# Altium schematic sheet ASIC_1.SchDoc: Title
size A2; Date: Date; CompanyName: Integrated Micro-Electronics Bulgaria; Organization: Design & Development Department; Address1: Drawing Type; Address2: Address 1; Address3: Address 2; Address4: Address 3; DocumentNumber: 730xxx; Revision: 01; SheetNumber: 1; SheetTotal: 1; PageSetup: Record=PageOptions|CenterHorizontal=True|CenterVertical=True|PrintScale=0.70|XCorrection=1.00|YCorrection=1.00|PrintKind=2|BorderSize=5000000|LeftOffset=0|BottomOffset=0|Orientation=2|PaperLength=1000|PaperWidth=1000|Scale=100|PaperSource=7|PrintQuality=-4|MediaType=1|DitherType=10|PaperKind=A4|PrintScaleMode=1; SheetSize: A3; Time: Time; ModifiedDate: Mod. Date
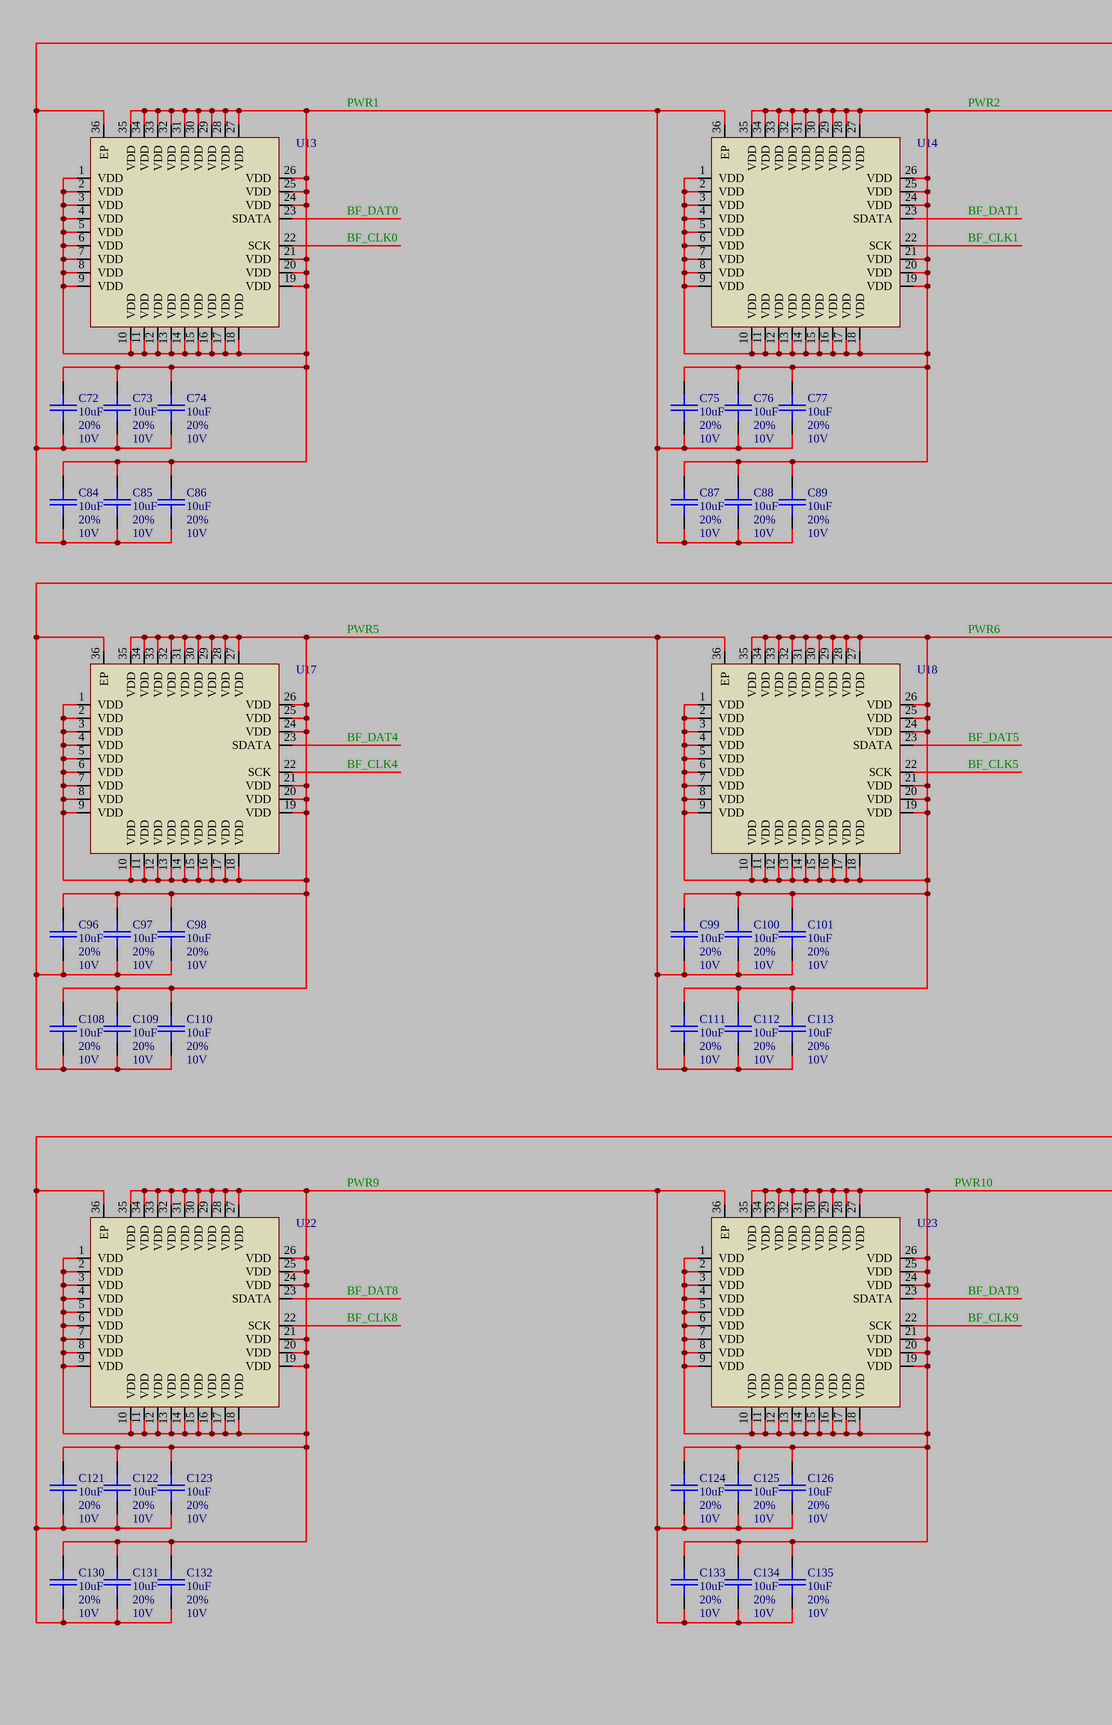
[diagram p0: ASIC_1.SchDoc, left]
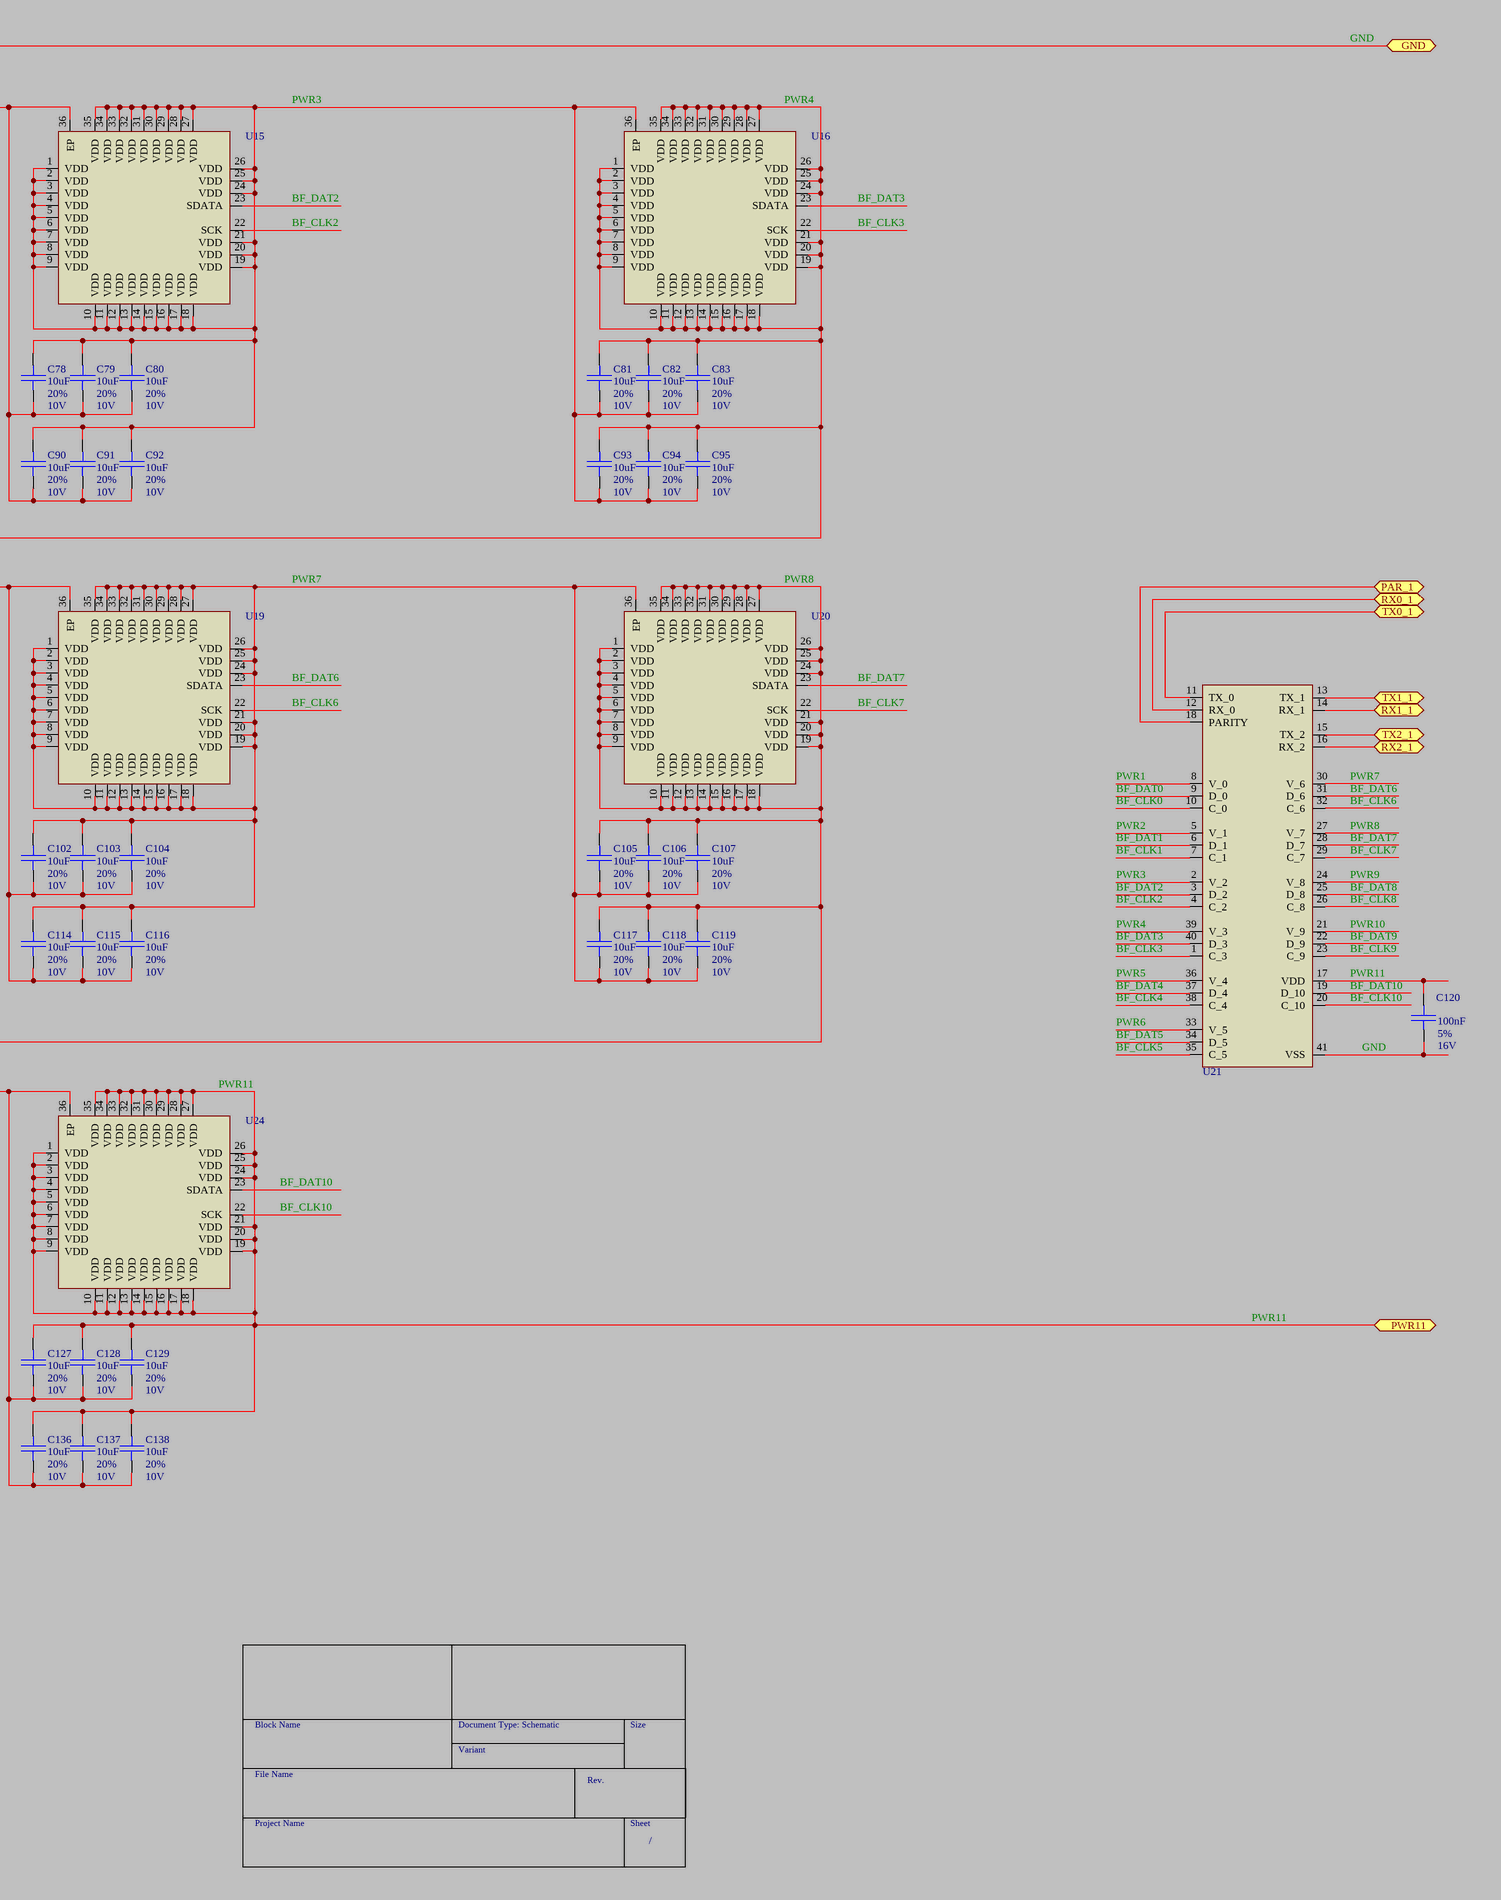
[diagram p1: ASIC_1.SchDoc, right]

## Parts
C72  DB_VALUE: 10uF  DB_TOLERANCE: 20%  DB_VOLTAGE: 10V  [SMD_0402_CAPC1005X70N]  (hidden comment: C)
C73  DB_VALUE: 10uF  DB_TOLERANCE: 20%  DB_VOLTAGE: 10V  [SMD_0402_CAPC1005X70N]  (hidden comment: C)
C74  DB_VALUE: 10uF  DB_TOLERANCE: 20%  DB_VOLTAGE: 10V  [SMD_0402_CAPC1005X70N]  (hidden comment: C)
C75  DB_VALUE: 10uF  DB_TOLERANCE: 20%  DB_VOLTAGE: 10V  [SMD_0402_CAPC1005X70N]  (hidden comment: C)
C76  DB_VALUE: 10uF  DB_TOLERANCE: 20%  DB_VOLTAGE: 10V  [SMD_0402_CAPC1005X70N]  (hidden comment: C)
C77  DB_VALUE: 10uF  DB_TOLERANCE: 20%  DB_VOLTAGE: 10V  [SMD_0402_CAPC1005X70N]  (hidden comment: C)
C78  DB_VALUE: 10uF  DB_TOLERANCE: 20%  DB_VOLTAGE: 10V  [SMD_0402_CAPC1005X70N]  (hidden comment: C)
C79  DB_VALUE: 10uF  DB_TOLERANCE: 20%  DB_VOLTAGE: 10V  [SMD_0402_CAPC1005X70N]  (hidden comment: C)
C80  DB_VALUE: 10uF  DB_TOLERANCE: 20%  DB_VOLTAGE: 10V  [SMD_0402_CAPC1005X70N]  (hidden comment: C)
C81  DB_VALUE: 10uF  DB_TOLERANCE: 20%  DB_VOLTAGE: 10V  [SMD_0402_CAPC1005X70N]  (hidden comment: C)
C82  DB_VALUE: 10uF  DB_TOLERANCE: 20%  DB_VOLTAGE: 10V  [SMD_0402_CAPC1005X70N]  (hidden comment: C)
C83  DB_VALUE: 10uF  DB_TOLERANCE: 20%  DB_VOLTAGE: 10V  [SMD_0402_CAPC1005X70N]  (hidden comment: C)
C84  DB_VALUE: 10uF  DB_TOLERANCE: 20%  DB_VOLTAGE: 10V  [SMD_0402_CAPC1005X70N]  (hidden comment: C)
C85  DB_VALUE: 10uF  DB_TOLERANCE: 20%  DB_VOLTAGE: 10V  [SMD_0402_CAPC1005X70N]  (hidden comment: C)
C86  DB_VALUE: 10uF  DB_TOLERANCE: 20%  DB_VOLTAGE: 10V  [SMD_0402_CAPC1005X70N]  (hidden comment: C)
C87  DB_VALUE: 10uF  DB_TOLERANCE: 20%  DB_VOLTAGE: 10V  [SMD_0402_CAPC1005X70N]  (hidden comment: C)
C88  DB_VALUE: 10uF  DB_TOLERANCE: 20%  DB_VOLTAGE: 10V  [SMD_0402_CAPC1005X70N]  (hidden comment: C)
C89  DB_VALUE: 10uF  DB_TOLERANCE: 20%  DB_VOLTAGE: 10V  [SMD_0402_CAPC1005X70N]  (hidden comment: C)
C90  DB_VALUE: 10uF  DB_TOLERANCE: 20%  DB_VOLTAGE: 10V  [SMD_0402_CAPC1005X70N]  (hidden comment: C)
C91  DB_VALUE: 10uF  DB_TOLERANCE: 20%  DB_VOLTAGE: 10V  [SMD_0402_CAPC1005X70N]  (hidden comment: C)
C92  DB_VALUE: 10uF  DB_TOLERANCE: 20%  DB_VOLTAGE: 10V  [SMD_0402_CAPC1005X70N]  (hidden comment: C)
C93  DB_VALUE: 10uF  DB_TOLERANCE: 20%  DB_VOLTAGE: 10V  [SMD_0402_CAPC1005X70N]  (hidden comment: C)
C94  DB_VALUE: 10uF  DB_TOLERANCE: 20%  DB_VOLTAGE: 10V  [SMD_0402_CAPC1005X70N]  (hidden comment: C)
C95  DB_VALUE: 10uF  DB_TOLERANCE: 20%  DB_VOLTAGE: 10V  [SMD_0402_CAPC1005X70N]  (hidden comment: C)
C96  DB_VALUE: 10uF  DB_TOLERANCE: 20%  DB_VOLTAGE: 10V  [SMD_0402_CAPC1005X70N]  (hidden comment: C)
C97  DB_VALUE: 10uF  DB_TOLERANCE: 20%  DB_VOLTAGE: 10V  [SMD_0402_CAPC1005X70N]  (hidden comment: C)
C98  DB_VALUE: 10uF  DB_TOLERANCE: 20%  DB_VOLTAGE: 10V  [SMD_0402_CAPC1005X70N]  (hidden comment: C)
C99  DB_VALUE: 10uF  DB_TOLERANCE: 20%  DB_VOLTAGE: 10V  [SMD_0402_CAPC1005X70N]  (hidden comment: C)
C100  DB_VALUE: 10uF  DB_TOLERANCE: 20%  DB_VOLTAGE: 10V  [SMD_0402_CAPC1005X70N]  (hidden comment: C)
C101  DB_VALUE: 10uF  DB_TOLERANCE: 20%  DB_VOLTAGE: 10V  [SMD_0402_CAPC1005X70N]  (hidden comment: C)
C102  DB_VALUE: 10uF  DB_TOLERANCE: 20%  DB_VOLTAGE: 10V  [SMD_0402_CAPC1005X70N]  (hidden comment: C)
C103  DB_VALUE: 10uF  DB_TOLERANCE: 20%  DB_VOLTAGE: 10V  [SMD_0402_CAPC1005X70N]  (hidden comment: C)
C104  DB_VALUE: 10uF  DB_TOLERANCE: 20%  DB_VOLTAGE: 10V  [SMD_0402_CAPC1005X70N]  (hidden comment: C)
C105  DB_VALUE: 10uF  DB_TOLERANCE: 20%  DB_VOLTAGE: 10V  [SMD_0402_CAPC1005X70N]  (hidden comment: C)
C106  DB_VALUE: 10uF  DB_TOLERANCE: 20%  DB_VOLTAGE: 10V  [SMD_0402_CAPC1005X70N]  (hidden comment: C)
C107  DB_VALUE: 10uF  DB_TOLERANCE: 20%  DB_VOLTAGE: 10V  [SMD_0402_CAPC1005X70N]  (hidden comment: C)
C108  DB_VALUE: 10uF  DB_TOLERANCE: 20%  DB_VOLTAGE: 10V  [SMD_0402_CAPC1005X70N]  (hidden comment: C)
C109  DB_VALUE: 10uF  DB_TOLERANCE: 20%  DB_VOLTAGE: 10V  [SMD_0402_CAPC1005X70N]  (hidden comment: C)
C110  DB_VALUE: 10uF  DB_TOLERANCE: 20%  DB_VOLTAGE: 10V  [SMD_0402_CAPC1005X70N]  (hidden comment: C)
C111  DB_VALUE: 10uF  DB_TOLERANCE: 20%  DB_VOLTAGE: 10V  [SMD_0402_CAPC1005X70N]  (hidden comment: C)
C112  DB_VALUE: 10uF  DB_TOLERANCE: 20%  DB_VOLTAGE: 10V  [SMD_0402_CAPC1005X70N]  (hidden comment: C)
C113  DB_VALUE: 10uF  DB_TOLERANCE: 20%  DB_VOLTAGE: 10V  [SMD_0402_CAPC1005X70N]  (hidden comment: C)
C114  DB_VALUE: 10uF  DB_TOLERANCE: 20%  DB_VOLTAGE: 10V  [SMD_0402_CAPC1005X70N]  (hidden comment: C)
C115  DB_VALUE: 10uF  DB_TOLERANCE: 20%  DB_VOLTAGE: 10V  [SMD_0402_CAPC1005X70N]  (hidden comment: C)
C116  DB_VALUE: 10uF  DB_TOLERANCE: 20%  DB_VOLTAGE: 10V  [SMD_0402_CAPC1005X70N]  (hidden comment: C)
C117  DB_VALUE: 10uF  DB_TOLERANCE: 20%  DB_VOLTAGE: 10V  [SMD_0402_CAPC1005X70N]  (hidden comment: C)
C118  DB_VALUE: 10uF  DB_TOLERANCE: 20%  DB_VOLTAGE: 10V  [SMD_0402_CAPC1005X70N]  (hidden comment: C)
C119  DB_VALUE: 10uF  DB_TOLERANCE: 20%  DB_VOLTAGE: 10V  [SMD_0402_CAPC1005X70N]  (hidden comment: C)
C120  DB_VALUE: 100nF  DB_TOLERANCE: 5%  DB_VOLTAGE: 16V  [SMD_0603_CAPC1608X95N]  (hidden comment: C)
C121  DB_VALUE: 10uF  DB_TOLERANCE: 20%  DB_VOLTAGE: 10V  [SMD_0402_CAPC1005X70N]  (hidden comment: C)
C122  DB_VALUE: 10uF  DB_TOLERANCE: 20%  DB_VOLTAGE: 10V  [SMD_0402_CAPC1005X70N]  (hidden comment: C)
C123  DB_VALUE: 10uF  DB_TOLERANCE: 20%  DB_VOLTAGE: 10V  [SMD_0402_CAPC1005X70N]  (hidden comment: C)
C124  DB_VALUE: 10uF  DB_TOLERANCE: 20%  DB_VOLTAGE: 10V  [SMD_0402_CAPC1005X70N]  (hidden comment: C)
C125  DB_VALUE: 10uF  DB_TOLERANCE: 20%  DB_VOLTAGE: 10V  [SMD_0402_CAPC1005X70N]  (hidden comment: C)
C126  DB_VALUE: 10uF  DB_TOLERANCE: 20%  DB_VOLTAGE: 10V  [SMD_0402_CAPC1005X70N]  (hidden comment: C)
C127  DB_VALUE: 10uF  DB_TOLERANCE: 20%  DB_VOLTAGE: 10V  [SMD_0402_CAPC1005X70N]  (hidden comment: C)
C128  DB_VALUE: 10uF  DB_TOLERANCE: 20%  DB_VOLTAGE: 10V  [SMD_0402_CAPC1005X70N]  (hidden comment: C)
C129  DB_VALUE: 10uF  DB_TOLERANCE: 20%  DB_VOLTAGE: 10V  [SMD_0402_CAPC1005X70N]  (hidden comment: C)
C130  DB_VALUE: 10uF  DB_TOLERANCE: 20%  DB_VOLTAGE: 10V  [SMD_0402_CAPC1005X70N]  (hidden comment: C)
C131  DB_VALUE: 10uF  DB_TOLERANCE: 20%  DB_VOLTAGE: 10V  [SMD_0402_CAPC1005X70N]  (hidden comment: C)
C132  DB_VALUE: 10uF  DB_TOLERANCE: 20%  DB_VOLTAGE: 10V  [SMD_0402_CAPC1005X70N]  (hidden comment: C)
C133  DB_VALUE: 10uF  DB_TOLERANCE: 20%  DB_VOLTAGE: 10V  [SMD_0402_CAPC1005X70N]  (hidden comment: C)
C134  DB_VALUE: 10uF  DB_TOLERANCE: 20%  DB_VOLTAGE: 10V  [SMD_0402_CAPC1005X70N]  (hidden comment: C)
C135  DB_VALUE: 10uF  DB_TOLERANCE: 20%  DB_VOLTAGE: 10V  [SMD_0402_CAPC1005X70N]  (hidden comment: C)
C136  DB_VALUE: 10uF  DB_TOLERANCE: 20%  DB_VOLTAGE: 10V  [SMD_0402_CAPC1005X70N]  (hidden comment: C)
C137  DB_VALUE: 10uF  DB_TOLERANCE: 20%  DB_VOLTAGE: 10V  [SMD_0402_CAPC1005X70N]  (hidden comment: C)
C138  DB_VALUE: 10uF  DB_TOLERANCE: 20%  DB_VOLTAGE: 10V  [SMD_0402_CAPC1005X70N]  (hidden comment: C)
U13  IC_BITFURY16  [SMD_QFN50P600X600X175-36AN]  (value not drawn)
U14  IC_BITFURY16  [SMD_QFN50P600X600X175-36AN]  (value not drawn)
U15  IC_BITFURY16  [SMD_QFN50P600X600X175-36AN]  (value not drawn)
U16  IC_BITFURY16  [SMD_QFN50P600X600X175-36AN]  (value not drawn)
U17  IC_BITFURY16  [SMD_QFN50P600X600X175-36AN]  (value not drawn)
U18  IC_BITFURY16  [SMD_QFN50P600X600X175-36AN]  (value not drawn)
U19  IC_BITFURY16  [SMD_QFN50P600X600X175-36AN]  (value not drawn)
U20  IC_BITFURY16  [SMD_QFN50P600X600X175-36AN]  (value not drawn)
U21  IC_BTC250  [SMD_QFN40P500X500X80-41N]  (value not drawn)
U22  IC_BITFURY16  [SMD_QFN50P600X600X175-36AN]  (value not drawn)
U23  IC_BITFURY16  [SMD_QFN50P600X600X175-36AN]  (value not drawn)
U24  IC_BITFURY16  [SMD_QFN50P600X600X175-36AN]  (value not drawn)

## Ports
GND, PAR_1, PWR11, RX0_1, RX1_1, RX2_1, TX0_1, TX1_1, TX2_1

## Nets
BF_CLK0: U13.22(SCK) U21.10(C_0)
BF_CLK1: U14.22(SCK) U21.7(C_1)
BF_CLK2: U15.22(SCK) U21.4(C_2)
BF_CLK3: U16.22(SCK) U21.1(C_3)
BF_CLK4: U17.22(SCK) U21.38(C_4)
BF_CLK5: U18.22(SCK) U21.35(C_5)
BF_CLK6: U19.22(SCK) U21.32(C_6)
BF_CLK7: U20.22(SCK) U21.29(C_7)
BF_CLK8: U21.26(C_8) U22.22(SCK)
BF_CLK9: U21.23(C_9) U23.22(SCK)
BF_CLK10: U21.20(C_10) U24.22(SCK)
BF_DAT0: U13.23(SDATA) U21.9(D_0)
BF_DAT1: U14.23(SDATA) U21.6(D_1)
BF_DAT2: U15.23(SDATA) U21.3(D_2)
BF_DAT3: U16.23(SDATA) U21.40(D_3)
BF_DAT4: U17.23(SDATA) U21.37(D_4)
BF_DAT5: U18.23(SDATA) U21.34(D_5)
BF_DAT6: U19.23(SDATA) U21.31(D_6)
BF_DAT7: U20.23(SDATA) U21.28(D_7)
BF_DAT8: U21.25(D_8) U22.23(SDATA)
BF_DAT9: U21.22(D_9) U23.23(SDATA)
BF_DAT10: U21.19(D_10) U24.23(SDATA)
GND: C72.2 C73.2 C74.2 C84.2 C85.2 C86.2 C120.2 U13.36(EP) U21.41(VSS) ; port GND
PAR_1: U21.18(PARITY) ; port PAR_1
PWR1: C72.1 C73.1 C74.1 C75.2 C76.2 C77.2 C84.1 C85.1 C86.1 C87.2 C88.2 C89.2 U13.1(VDD) U13.2(VDD) U13.3(VDD) U13.4(VDD) U13.5(VDD) U13.6(VDD) U13.7(VDD) U13.8(VDD) U13.9(VDD) U13.10(VDD) U13.11(VDD) U13.12(VDD) U13.13(VDD) U13.14(VDD) U13.15(VDD) U13.16(VDD) U13.17(VDD) U13.18(VDD) U13.19(VDD) U13.20(VDD) U13.21(VDD) U13.24(VDD) U13.25(VDD) U13.26(VDD) U13.27(VDD) U13.28(VDD) U13.29(VDD) U13.30(VDD) U13.31(VDD) U13.32(VDD) U13.33(VDD) U13.34(VDD) U13.35(VDD) U14.36(EP) U21.8(V_0)
PWR2: C75.1 C76.1 C77.1 C78.2 C79.2 C80.2 C87.1 C88.1 C89.1 C90.2 C91.2 C92.2 U14.1(VDD) U14.2(VDD) U14.3(VDD) U14.4(VDD) U14.5(VDD) U14.6(VDD) U14.7(VDD) U14.8(VDD) U14.9(VDD) U14.10(VDD) U14.11(VDD) U14.12(VDD) U14.13(VDD) U14.14(VDD) U14.15(VDD) U14.16(VDD) U14.17(VDD) U14.18(VDD) U14.19(VDD) U14.20(VDD) U14.21(VDD) U14.24(VDD) U14.25(VDD) U14.26(VDD) U14.27(VDD) U14.28(VDD) U14.29(VDD) U14.30(VDD) U14.31(VDD) U14.32(VDD) U14.33(VDD) U14.34(VDD) U14.35(VDD) U15.36(EP) U21.5(V_1)
PWR3: C78.1 C79.1 C80.1 C81.2 C82.2 C83.2 C90.1 C91.1 C92.1 C93.2 C94.2 C95.2 U15.1(VDD) U15.2(VDD) U15.3(VDD) U15.4(VDD) U15.5(VDD) U15.6(VDD) U15.7(VDD) U15.8(VDD) U15.9(VDD) U15.10(VDD) U15.11(VDD) U15.12(VDD) U15.13(VDD) U15.14(VDD) U15.15(VDD) U15.16(VDD) U15.17(VDD) U15.18(VDD) U15.19(VDD) U15.20(VDD) U15.21(VDD) U15.24(VDD) U15.25(VDD) U15.26(VDD) U15.27(VDD) U15.28(VDD) U15.29(VDD) U15.30(VDD) U15.31(VDD) U15.32(VDD) U15.33(VDD) U15.34(VDD) U15.35(VDD) U16.36(EP) U21.2(V_2)
PWR4: C81.1 C82.1 C83.1 C93.1 C94.1 C95.1 C96.2 C97.2 C98.2 C108.2 C109.2 C110.2 U16.1(VDD) U16.2(VDD) U16.3(VDD) U16.4(VDD) U16.5(VDD) U16.6(VDD) U16.7(VDD) U16.8(VDD) U16.9(VDD) U16.10(VDD) U16.11(VDD) U16.12(VDD) U16.13(VDD) U16.14(VDD) U16.15(VDD) U16.16(VDD) U16.17(VDD) U16.18(VDD) U16.19(VDD) U16.20(VDD) U16.21(VDD) U16.24(VDD) U16.25(VDD) U16.26(VDD) U16.27(VDD) U16.28(VDD) U16.29(VDD) U16.30(VDD) U16.31(VDD) U16.32(VDD) U16.33(VDD) U16.34(VDD) U16.35(VDD) U17.36(EP) U21.39(V_3)
PWR5: C96.1 C97.1 C98.1 C99.2 C100.2 C101.2 C108.1 C109.1 C110.1 C111.2 C112.2 C113.2 U17.1(VDD) U17.2(VDD) U17.3(VDD) U17.4(VDD) U17.5(VDD) U17.6(VDD) U17.7(VDD) U17.8(VDD) U17.9(VDD) U17.10(VDD) U17.11(VDD) U17.12(VDD) U17.13(VDD) U17.14(VDD) U17.15(VDD) U17.16(VDD) U17.17(VDD) U17.18(VDD) U17.19(VDD) U17.20(VDD) U17.21(VDD) U17.24(VDD) U17.25(VDD) U17.26(VDD) U17.27(VDD) U17.28(VDD) U17.29(VDD) U17.30(VDD) U17.31(VDD) U17.32(VDD) U17.33(VDD) U17.34(VDD) U17.35(VDD) U18.36(EP) U21.36(V_4)
PWR6: C99.1 C100.1 C101.1 C102.2 C103.2 C104.2 C111.1 C112.1 C113.1 C114.2 C115.2 C116.2 U18.1(VDD) U18.2(VDD) U18.3(VDD) U18.4(VDD) U18.5(VDD) U18.6(VDD) U18.7(VDD) U18.8(VDD) U18.9(VDD) U18.10(VDD) U18.11(VDD) U18.12(VDD) U18.13(VDD) U18.14(VDD) U18.15(VDD) U18.16(VDD) U18.17(VDD) U18.18(VDD) U18.19(VDD) U18.20(VDD) U18.21(VDD) U18.24(VDD) U18.25(VDD) U18.26(VDD) U18.27(VDD) U18.28(VDD) U18.29(VDD) U18.30(VDD) U18.31(VDD) U18.32(VDD) U18.33(VDD) U18.34(VDD) U18.35(VDD) U19.36(EP) U21.33(V_5)
PWR7: C102.1 C103.1 C104.1 C105.2 C106.2 C107.2 C114.1 C115.1 C116.1 C117.2 C118.2 C119.2 U19.1(VDD) U19.2(VDD) U19.3(VDD) U19.4(VDD) U19.5(VDD) U19.6(VDD) U19.7(VDD) U19.8(VDD) U19.9(VDD) U19.10(VDD) U19.11(VDD) U19.12(VDD) U19.13(VDD) U19.14(VDD) U19.15(VDD) U19.16(VDD) U19.17(VDD) U19.18(VDD) U19.19(VDD) U19.20(VDD) U19.21(VDD) U19.24(VDD) U19.25(VDD) U19.26(VDD) U19.27(VDD) U19.28(VDD) U19.29(VDD) U19.30(VDD) U19.31(VDD) U19.32(VDD) U19.33(VDD) U19.34(VDD) U19.35(VDD) U20.36(EP) U21.30(V_6)
PWR8: C105.1 C106.1 C107.1 C117.1 C118.1 C119.1 C121.2 C122.2 C123.2 C130.2 C131.2 C132.2 U20.1(VDD) U20.2(VDD) U20.3(VDD) U20.4(VDD) U20.5(VDD) U20.6(VDD) U20.7(VDD) U20.8(VDD) U20.9(VDD) U20.10(VDD) U20.11(VDD) U20.12(VDD) U20.13(VDD) U20.14(VDD) U20.15(VDD) U20.16(VDD) U20.17(VDD) U20.18(VDD) U20.19(VDD) U20.20(VDD) U20.21(VDD) U20.24(VDD) U20.25(VDD) U20.26(VDD) U20.27(VDD) U20.28(VDD) U20.29(VDD) U20.30(VDD) U20.31(VDD) U20.32(VDD) U20.33(VDD) U20.34(VDD) U20.35(VDD) U21.27(V_7) U22.36(EP)
PWR9: C121.1 C122.1 C123.1 C124.2 C125.2 C126.2 C130.1 C131.1 C132.1 C133.2 C134.2 C135.2 U21.24(V_8) U22.1(VDD) U22.2(VDD) U22.3(VDD) U22.4(VDD) U22.5(VDD) U22.6(VDD) U22.7(VDD) U22.8(VDD) U22.9(VDD) U22.10(VDD) U22.11(VDD) U22.12(VDD) U22.13(VDD) U22.14(VDD) U22.15(VDD) U22.16(VDD) U22.17(VDD) U22.18(VDD) U22.19(VDD) U22.20(VDD) U22.21(VDD) U22.24(VDD) U22.25(VDD) U22.26(VDD) U22.27(VDD) U22.28(VDD) U22.29(VDD) U22.30(VDD) U22.31(VDD) U22.32(VDD) U22.33(VDD) U22.34(VDD) U22.35(VDD) U23.36(EP)
PWR10: C124.1 C125.1 C126.1 C127.2 C128.2 C129.2 C133.1 C134.1 C135.1 C136.2 C137.2 C138.2 U21.21(V_9) U23.1(VDD) U23.2(VDD) U23.3(VDD) U23.4(VDD) U23.5(VDD) U23.6(VDD) U23.7(VDD) U23.8(VDD) U23.9(VDD) U23.10(VDD) U23.11(VDD) U23.12(VDD) U23.13(VDD) U23.14(VDD) U23.15(VDD) U23.16(VDD) U23.17(VDD) U23.18(VDD) U23.19(VDD) U23.20(VDD) U23.21(VDD) U23.24(VDD) U23.25(VDD) U23.26(VDD) U23.27(VDD) U23.28(VDD) U23.29(VDD) U23.30(VDD) U23.31(VDD) U23.32(VDD) U23.33(VDD) U23.34(VDD) U23.35(VDD) U24.36(EP)
PWR11: C120.1 C127.1 C128.1 C129.1 C136.1 C137.1 C138.1 U21.17(VDD) U24.1(VDD) U24.2(VDD) U24.3(VDD) U24.4(VDD) U24.5(VDD) U24.6(VDD) U24.7(VDD) U24.8(VDD) U24.9(VDD) U24.10(VDD) U24.11(VDD) U24.12(VDD) U24.13(VDD) U24.14(VDD) U24.15(VDD) U24.16(VDD) U24.17(VDD) U24.18(VDD) U24.19(VDD) U24.20(VDD) U24.21(VDD) U24.24(VDD) U24.25(VDD) U24.26(VDD) U24.27(VDD) U24.28(VDD) U24.29(VDD) U24.30(VDD) U24.31(VDD) U24.32(VDD) U24.33(VDD) U24.34(VDD) U24.35(VDD) ; port PWR11
RX0_1: U21.12(RX_0) ; port RX0_1
RX1_1: U21.14(RX_1) ; port RX1_1
RX2_1: U21.16(RX_2) ; port RX2_1
TX0_1: U21.11(TX_0) ; port TX0_1
TX1_1: U21.13(TX_1) ; port TX1_1
TX2_1: U21.15(TX_2) ; port TX2_1

## Notes on the sheet
- Block Name
- Document Type: Schematic
- Size
- File Name
- Variant
- Rev.
- Project Name
- Sheet
- /

## Library data of the parts
C72-C119 C121-C138 = CAP000047481: DB_PART_TYPE: Ceramic_SMD\Standard_X5R; DB_MANUFACTURER_PART: SAMSUNG    CL05A106MP5NUNC; NOTE: <NOTE>; DB_T_RANGE: -55 to 85; DB_PACKAGE: 0402; DB_DESCRIPTION: C X5R 10uF 20% 10V 0402; DB_APPROVED_BY: VSN; DB_STATUS: NEW; DB_PART_NUMBER: CAP000047481; DB_PCB_DEVICE: SMD_0402_CAPC1005X70N; DB_APPROVED_ON: 20.04.2016 14:32:27; DB_DATASHEET: http://john.epiqdesign.com/projects/CIS_Datasheets/CAP_S_CL05A106MP5NUNC.pdf?rev=2053&sc=0
C120 = CAP000027134: DB_PART_TYPE: Ceramic_SMD\Standard_X7R; DB_MANUFACTURER_PART: KEMET    C0603C104J4RAC; NOTE: <NOTE>; DB_T_RANGE: -55 to 125; DB_PACKAGE: 0603; DB_DESCRIPTION: C X7R 100nF 5% 16V 0603; DB_STATUS: NEW; DB_PART_NUMBER: CAP000027134; DB_PCB_DEVICE: SMD_0603_CAPC1608X95N; DB_APPROVED_ON: 09.10.2010; DB_DATASHEET: http://john.epiqdesign.com/projects/CIS_Datasheets/F3102_CE_Kemet.pdf?rev=92&sc=0
U13-U20 U22-U24 = IC_BITFURY16: BitFury 2016 16 nm; DB_PACKAGE: FCLGA 35L 6x6mm; DB_VALUE: BF8162C16; DB_DESCRIPTION: BitFury 2016 16 nm; DB_PCB_DEVICE: SMD_QFN50P600X600X175-36AN
U21 = IC_BTC250: DB_MANUFACTURER_PART: BTC250 QFN40 EP; DB_PACKAGE: QFN40 EP; DB_VALUE: BTC250; DB_PCB_DEVICE: SMD_QFN40P500X500X80-41N